# Altium schematic sheet MCU.SchDoc
size A3; DocumentNumber: 5; SheetNumber: 5; SheetTotal: 10
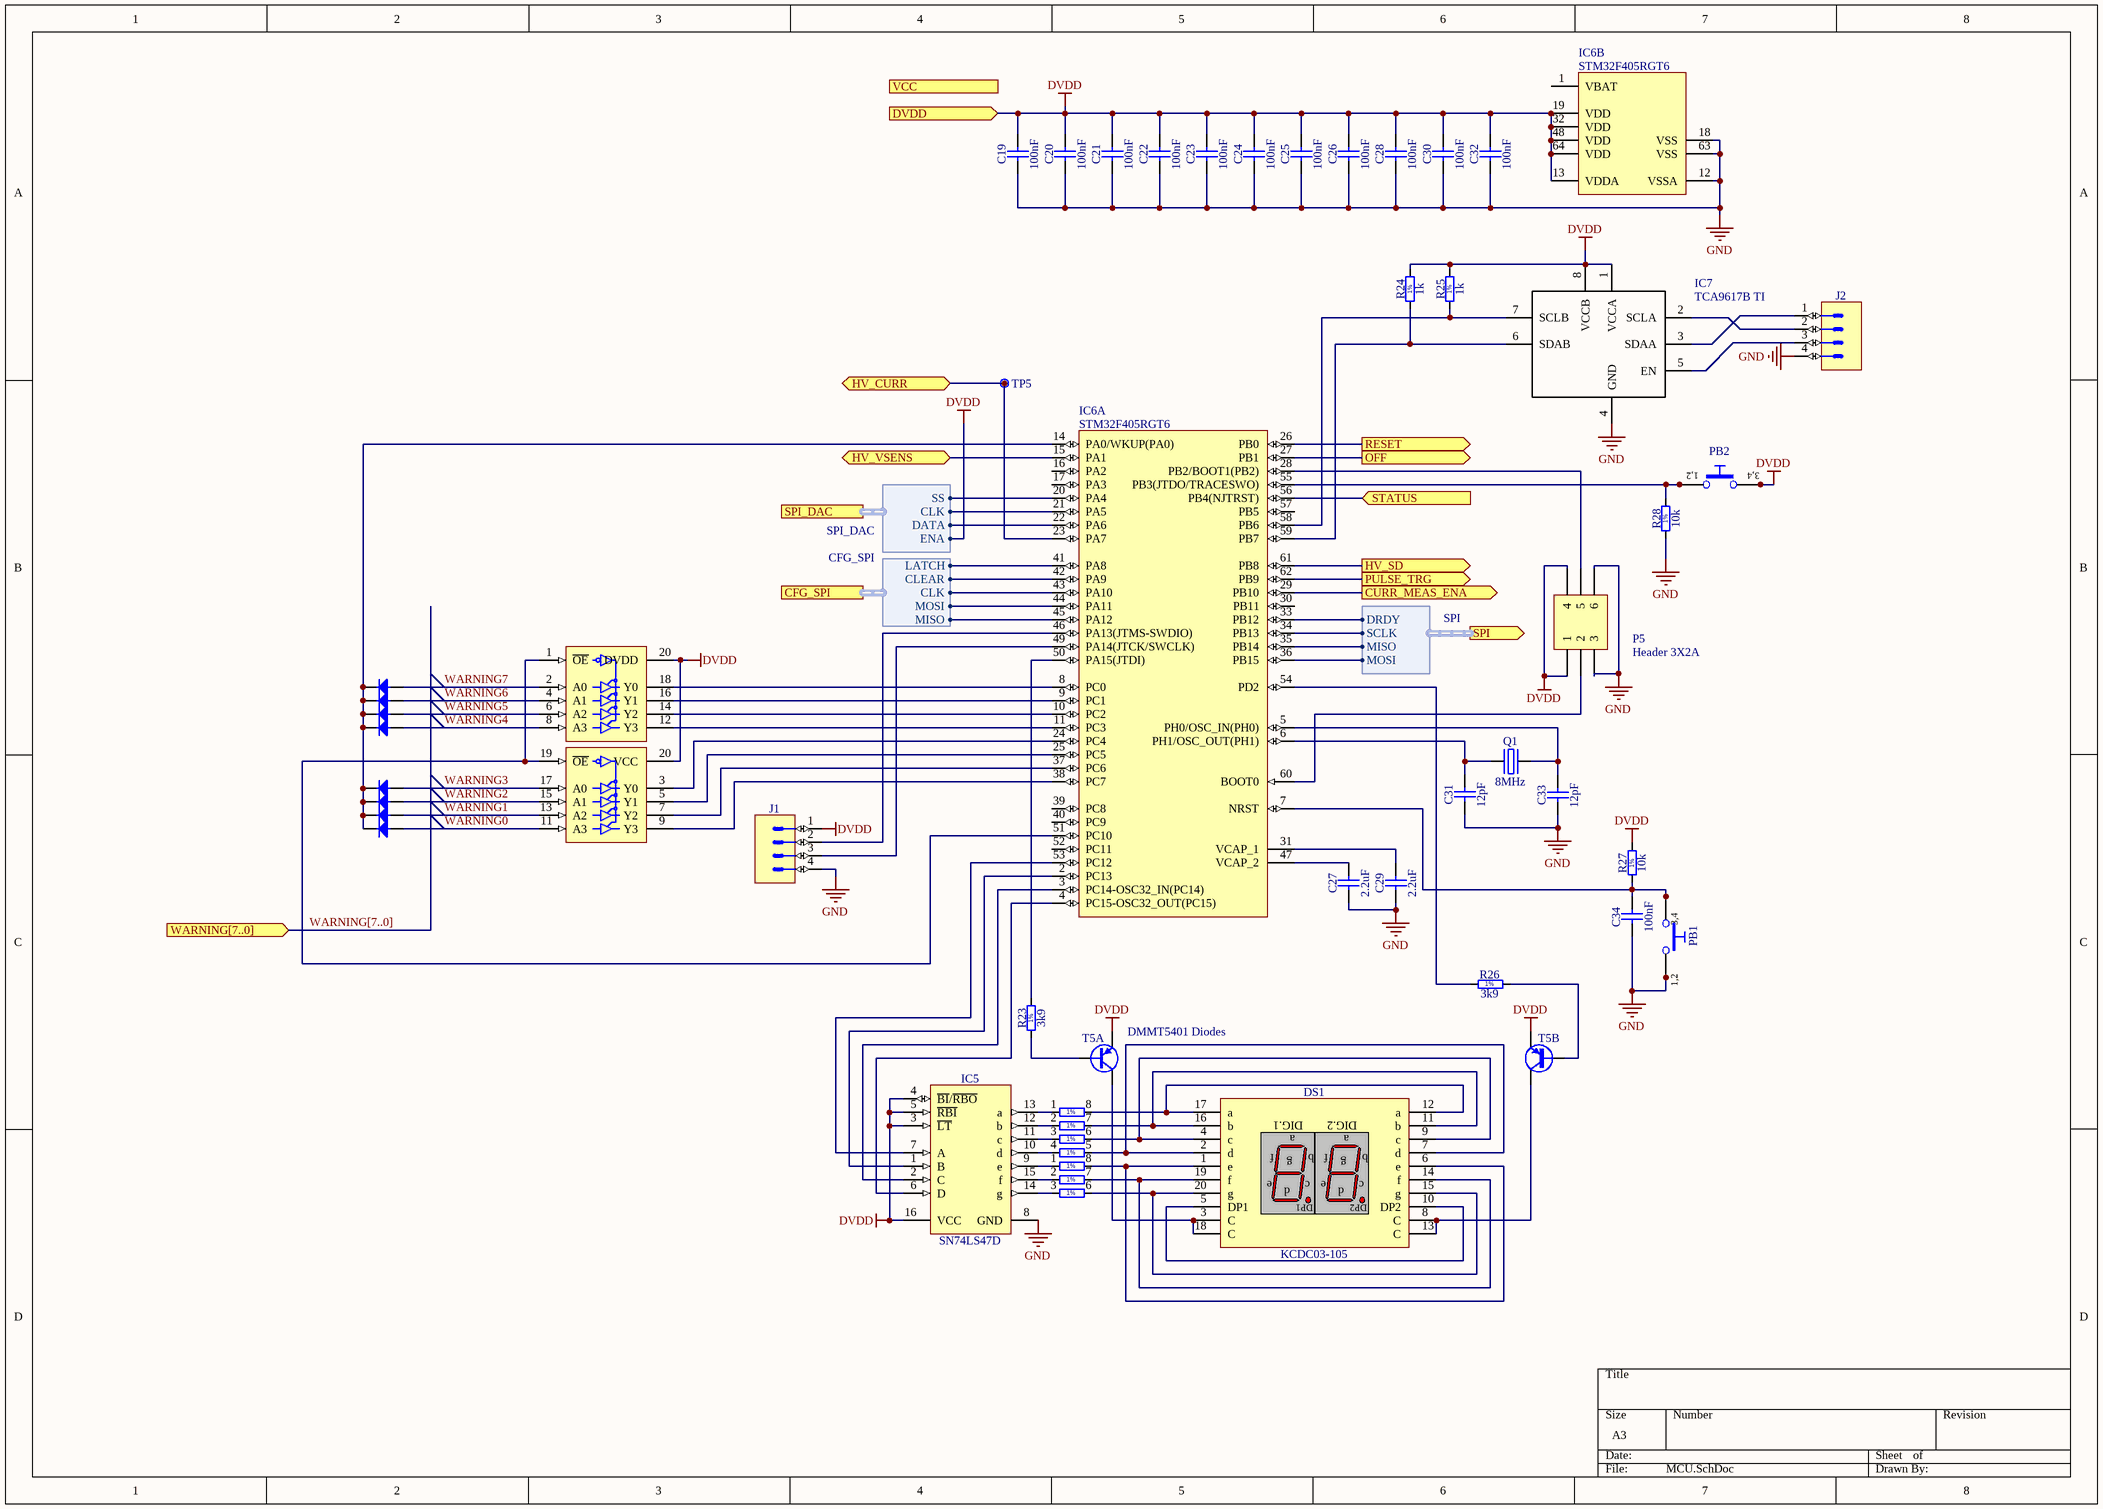
[diagram p0: MCU.SchDoc]

## Parts
C19  100nF  [CAPC2012X135N]
C20  100nF  [CAPC2012X135N]
C21  100nF  [CAPC2012X135N]
C22  100nF  [CAPC2012X135N]
C23  100nF  [CAPC2012X135N]
C24  100nF  [CAPC2012X135N]
C25  100nF  [CAPC2012X135N]
C26  100nF  [CAPC2012X135N]
C27  2.2uF  [CAPC2012X135N]
C28  100nF  [CAPC2012X135N]
C29  2.2uF  [CAPC2012X135N]
C30  100nF  [CAPC2012X135N]
C31  12pF  [CAPC2012X135N]
C32  100nF  [CAPC2012X135N]
C33  12pF  [CAPC2012X135N]
C34  100nF  [CAPC2012X135N]
D3  MCL4148-TR3  [DIOMELF1911N]  (value not drawn)
D4  MCL4148-TR3  [DIOMELF1911N]  (value not drawn)
D5  MCL4148-TR3  [DIOMELF1911N]  (value not drawn)
D6  MCL4148-TR3  [DIOMELF1911N]  (value not drawn)
D7  MCL4148-TR3  [DIOMELF1911N]  (value not drawn)
D8  MCL4148-TR3  [DIOMELF1911N]  (value not drawn)
D9  MCL4148-TR3  [DIOMELF1911N]  (value not drawn)
D10  MCL4148-TR3  [DIOMELF1911N]  (value not drawn)
DS1  KCDC03-105  [DS_KINGBRIGHT_KCDC03-105]
IC4  74HCT244D  [SOIC127P1032X265-20N]  (value not drawn)  (parts A,B of 2)
IC5  SN74LS47D  [SOIC127P600X175-16N]
IC6  STM32F405RGT6  [QFP50P1200X1200X160-64N]  (parts A,B of 2)
IC7  TCA9617B TI  [TSOP65P490X110-8N]
J1  Header 4  [PRECI-DIP_350-V3-104-00-001101]  (value not drawn)
J2  Header 4  [PRECI-DIP_350-V3-104-00-001101]  (value not drawn)
P5  Header 3X2A  [HDR2X3_CEN]
PB1  Push Button  [PB_OMRON_B3F-1000]  (value not drawn)
PB2  Push Button  [PB_OMRON_B3F-1000]  (value not drawn)
Q1  8MHz  [XTAL_TXC_7A]
R23  3k9  [RESC2012X60N]
R24  1k  [RESC2012X60N]
R25  1k  [RESC2012X60N]
R26  3k9  [RESC2012X60N]
R27  10k  [RESC2012X60N]
R28  10k  [RESC2012X60N]
RN1  220  [RN_VISHAY_CRA12E08]  (value not drawn)  (parts A,B,C,D of 4)
RN2  220  [RN_VISHAY_CRA12E08]  (value not drawn)  (parts A,B,C of 4)
T5  DMMT5401 Diodes  [SOT95P280X145-6N]  (parts A,B of 2)
TP5  Test Point  [VERO_20-2136]  (value not drawn)

## Ports
CFG_SPI (harness CFG_SPI), CURR_MEAS_ENA (out), DVDD (in), HV_CURR (bidir), HV_SD (out), HV_VSENS (bidir), OFF (out), PULSE_TRG (out), RESET (out), SPI (out, harness SPI), SPI_DAC (harness SPI_DAC), STATUS (in), VCC (in), WARNING[7..0] (in)

## Harnesses
SPI_DAC: SS, CLK, DATA, ENA
SPI: DRDY, MISO, SCLK, MOSI
CFG_SPI: LATCH, CLEAR, CLK, MOSI, MISO

## Nets
DVDD: C19.2 C20.2 C21.2 C22.2 C23.2 C24.2 C25.2 C26.2 C28.2 C30.2 C32.2 IC4.20(DVDD) IC5.3(~{LT}) IC5.4(~{BI}/~{RBO}) IC5.5(~{RBI}) IC5.16(VCC) IC6.13(VDDA) IC6.19(VDD) IC6.32(VDD) IC6.48(VDD) IC6.64(VDD) IC7.1(VCCA) IC7.8(VCCB) J1.1 P5.1 P5.4 PB2.3 PB2.4 R24.2 R25.2 R27.2 T5.5(E) T5.6(E) ; port DVDD, port SPI_DAC.ENA
GND: C19.1 C20.1 C21.1 C22.1 C23.1 C24.1 C25.1 C26.1 C27.1 C28.1 C29.1 C30.1 C31.1 C32.1 C33.1 C34.1 IC4.10(GND) IC5.8(GND) IC6.12(VSSA) IC6.18(VSS) IC6.63(VSS) IC7.4(GND) J1.4 J2.4 P5.3 P5.6 PB1.1 PB1.2 R28.1
CURR_MEAS_ENA: IC6.29(PB10) ; port CURR_MEAS_ENA
HV_CURR: IC6.23(PA7) TP5.1 ; port HV_CURR
HV_SD: IC6.61(PB8) ; port HV_SD
HV_VSENS: IC6.15(PA1) ; port HV_VSENS
OFF: IC6.27(PB1) ; port OFF
PULSE_TRG: IC6.62(PB9) ; port PULSE_TRG
RESET: IC6.26(PB0) ; port RESET
STATUS: IC6.56(PB4(NJTRST)) ; port STATUS
WARNING0: D10.2(A) IC4.11(A3)
WARNING1: D9.2(A) IC4.13(A2)
WARNING2: D8.2(A) IC4.15(A1)
WARNING3: D7.2(A) IC4.17(A0)
WARNING4: D6.2(A) IC4.8(A3)
WARNING5: D5.2(A) IC4.6(A2)
WARNING6: D4.2(A) IC4.4(A1)
WARNING7: D3.2(A) IC4.2(A0)
NetC27_2: C27.2 IC6.47(VCAP_2)
NetC29_2: C29.2 IC6.31(VCAP_1)
NetC31_2: C31.2 IC6.6(PH1/OSC_OUT(PH1)) Q1.1(OSC1)
NetC33_2: C33.2 IC6.5(PH0/OSC_IN(PH0)) Q1.2(OSC2)
NetC34_2: C34.2 IC6.7(NRST) PB1.3 PB1.4 R27.1
NetD3_1: D3.1(C) D4.1(C) D5.1(C) D6.1(C) D7.1(C) D8.1(C) D9.1(C) D10.1(C) IC6.14(PA0/WKUP(PA0))
NetDS1_1: DS1.1(e) DS1.6(e) RN2.8
NetDS1_2: DS1.2(d) DS1.7(d) RN1.5
NetDS1_3: DS1.3(C) DS1.18(C) T5.1(C)
NetDS1_4: DS1.4(c) DS1.9(c) RN1.6
NetDS1_5: DS1.5(DP1) DS1.10(DP2)
NetDS1_8: DS1.8(C) DS1.13(C) T5.4(C)
NetDS1_11: DS1.11(b) DS1.16(b) RN1.7
NetDS1_12: DS1.12(a) DS1.17(a) RN1.8
NetDS1_14: DS1.14(f) DS1.19(f) RN2.7
NetDS1_15: DS1.15(g) DS1.20(g) RN2.6
NetIC4_1: IC4.1(~{OE}) IC4.19(~{OE}) IC6.51(PC10)
NetIC4_3: IC4.3(Y0) IC6.24(PC4)
NetIC4_5: IC4.5(Y1) IC6.25(PC5)
NetIC4_7: IC4.7(Y2) IC6.37(PC6)
NetIC4_9: IC4.9(Y3) IC6.38(PC7)
NetIC4_12: IC4.12(Y3) IC6.11(PC3)
NetIC4_14: IC4.14(Y2) IC6.10(PC2)
NetIC4_16: IC4.16(Y1) IC6.9(PC1)
NetIC4_18: IC4.18(Y0) IC6.8(PC0)
NetIC5_1: IC5.1(B) IC6.2(PC13)
NetIC5_2: IC5.2(C) IC6.3(PC14-OSC32_IN(PC14))
NetIC5_6: IC5.6(D) IC6.4(PC15-OSC32_OUT(PC15))
NetIC5_7: IC5.7(A) IC6.53(PC12)
NetIC5_9: IC5.9(e) RN2.1
NetIC5_10: IC5.10(d) RN1.4
NetIC5_11: IC5.11(c) RN1.3
NetIC5_12: IC5.12(b) RN1.2
NetIC5_13: IC5.13(a) RN1.1
NetIC5_14: IC5.14(g) RN2.3
NetIC5_15: IC5.15(f) RN2.2
NetIC6_20: IC6.20(PA4) ; port SPI_DAC.SS
NetIC6_21: IC6.21(PA5) ; port SPI_DAC.CLK
NetIC6_22: IC6.22(PA6) ; port SPI_DAC.DATA
NetIC6_28: IC6.28(PB2/BOOT1(PB2)) P5.5
NetIC6_33: IC6.33(PB12) ; port SPI.DRDY
NetIC6_34: IC6.34(PB13) ; port SPI.SCLK
NetIC6_35: IC6.35(PB14) ; port SPI.MISO
NetIC6_36: IC6.36(PB15) ; port SPI.MOSI
NetIC6_41: IC6.41(PA8) ; port CFG_SPI.LATCH
NetIC6_42: IC6.42(PA9) ; port CFG_SPI.CLEAR
NetIC6_43: IC6.43(PA10) ; port CFG_SPI.CLK
NetIC6_44: IC6.44(PA11) ; port CFG_SPI.MOSI
NetIC6_45: IC6.45(PA12) ; port CFG_SPI.MISO
NetIC6_46: IC6.46(PA13(JTMS-SWDIO)) J1.2
NetIC6_49: IC6.49(PA14(JTCK/SWCLK)) J1.3
NetIC6_50: IC6.50(PA15(JTDI)) R23.2
NetIC6_54: IC6.54(PD2) R26.1
NetIC6_55: IC6.55(PB3(JTDO/TRACESWO)) PB2.1 PB2.2 R28.2
NetIC6_58: IC6.58(PB6) IC7.7(SCLB) R25.1
NetIC6_59: IC6.59(PB7) IC7.6(SDAB) R24.1
NetIC6_60: IC6.60(BOOT0) P5.2
NetIC7_2: IC7.2(SCLA) J2.2
NetIC7_3: IC7.3(SDAA) J2.1
NetIC7_5: IC7.5(EN) J2.3
NetR23_1: R23.1 T5.2(B)
NetR26_2: R26.2 T5.3(B)

Not connected (* = marked no-connect by the designer): IC6 1(VBAT) 16(PA2) 17(PA3) 30(PB11) 39(PC8) 40(PC9) 52(PC11) 57(PB5)

## Buses and harness runs
bus WARNING[7..0] = port WARNING[7..0]

## Notes on the sheet
- (in symbol DS_KINGBRIGHT_KCDC03-105) DIG.1; DIG.2
- (in symbol PB_OMRON_B3F-1000) 3,4; 1,2
- (in symbol R0805_1K_1%_0.125W_100PPM) 1%
- (in symbol R0805_3K9_1%_0.125W_100PPM) 1%
- (in symbol R0805_10K_1%_0.125W_100PPM) 1%
- (in symbol RN_220R_VISHAY_CRA12E083220RF, part A) 1%
- (in symbol RN_220R_VISHAY_CRA12E083220RF, part B) 1%
- (in symbol RN_220R_VISHAY_CRA12E083220RF, part C) 1%
- (in symbol RN_220R_VISHAY_CRA12E083220RF, part D) 1%

## Library data of the parts
C19-C26 C28 C30 C32 C34 = CC0805_100NF_50V_10%_X7R: Non-polarised capacitor; Part Description: SMD Multilayer Chip Ceramic Capacitor; Manufacturer: GENERIC; Manufacturer1 Part Number: C2012X7R1H104K085AA; Voltage: 50V; TC: X7R; Tolerance: ±10%; Part Number: CC0805_100NF_50V_10%_X7R; Component Kind: Standard; Component Type: Standard; Pin Count: 2; Value: 100nF; Status: Preferred; Manufacturer Part Number: CC0805_100NF_50V_10%_X7R; Case: 0805; Mounted: Yes; Socket: No; SMD: Yes; Sense: No; Manufacturer1 Example: TDK; Manufacturer1 ComponentHeight: 1mm; HelpURL: \\cern.ch\dfs\Applications\Altium\Datasheets\CC0805_X7R_TDK_C.pdf; Author: CERN DEM JLC; CreateDate: 03.12.2007; LatestRevisionDate: 22.04.2015
C27 C29 = CC0805_2.2UF_16V_10%_X7R: Non-polarised capacitor; Part Description: SMD Multilayer Chip Ceramic Capacitor; Manufacturer: GENERIC; Manufacturer1 Part Number: GRM21BF51C225ZA01L; Voltage: 16V; TC: X7R; Tolerance: ±10%; Part Number: CC0805_2.2UF_16V_10%_X7R; Component Kind: Standard; Component Type: Standard; Pin Count: 2; Value: 2.2uF; Status: Preferred; Manufacturer Part Number: CC0805_2.2UF_16V_10%_X7R; Case: 0805; Mounted: Yes; Socket: No; SMD: Yes; Sense: No; Manufacturer1 Example: MURATA; Manufacturer1 ComponentHeight: 1.5mm; HelpURL: \\cern.ch\dfs\Applications\Altium\Datasheets\CC0805_X7R_MURATA_GRM.pdf; Author: CERN DEM JLC; CreateDate: 03.12.2007; LatestRevisionDate: 18.09.2014
C31 C33 = CC0805_12PF_50V_5%_NP0: Non-polarised capacitor; Part Description: SMD Multilayer Chip Ceramic Capacitor; Manufacturer: GENERIC; Manufacturer1 Part Number: 223886115129; Voltage: 50V; TC: C0G/NP0; Tolerance: ±5%; Part Number: CC0805_12PF_50V_5%_NP0; Component Kind: Standard; Component Type: Standard; Pin Count: 2; Value: 12pF; Status: Preferred; Manufacturer Part Number: CC0805_12PF_50V_5%_NP0; Case: 0805; Mounted: Yes; Socket: No; SMD: Yes; Sense: No; Manufacturer1 Example: PHYCOMP; Manufacturer1 ComponentHeight: 1.35mm; HelpURL: \\cern.ch\dfs\Applications\Altium\Datasheets\CC0805_NP0_PHYCOMP.pdf; Author: CERN DEM JLC; CreateDate: 03.12.2007; LatestRevisionDate: 03.12.2007
D3-D10 = MCL4148-TR3: Diode; Part Description: Small Signal Fast Switching Diode; Manufacturer: VISHAY GENERAL SEMICONDUCTOR; Voltage: 75V; Power: 200mA; PressFit: No; Bonding: No; Part Number: MCL4148-TR3; Component Kind: Standard; Component Type: Standard; Device: MCL4148-TR3; PackageDescription: MELF Diode, 2-Leads, Body 1.7x1.15mm, IPC Medium Density; Status: Not recommended; Manufacturer Part Number: MCL4148-TR3; Pin Count: 2; Mounted: Yes; Socket: No; SMD: Yes; Sense: No; ComponentHeight: 1.35mm; HelpURL: \\cern.ch\dfs\Applications\Altium\Datasheets\MCL4148-TR3.pdf; Author: CERN DEM JLC; CreateDate: 10.11.2014; LatestRevisionDate: 10.11.2014
DS1 = DS_KINGBRIGHT_KCDC03-105: Dual Digit, SMD 7-Segment Common Cathode Hyper Red Display; PressFit: No; Bonding: No; Part Number: DS_KINGBRIGHT_KCDC03-105; Component Kind: Standard; Component Type: Standard; Color: Hyper Red; Device: KCDC03-105; PackageDescription: 20-Leads, Body 14.8x12mm, Pitch 1.5mm, Hyper Red SMD Common Cathode Dual 7-SegmentDisplay; Part Description: Dual Digit, SMD 7-Segment Common Cathode Hyper Red Display; Manufacturer: KINGBRIGHT; Manufacturer Part Number: KCDC03-105; Pin Count: 20; Mounted: Yes; Socket: No; SMD: Yes; Sense: No; ComponentHeight: 3.75mm; HelpURL: \\cern.ch\dfs\Applications\Altium\Datasheets\DS_KINGBRIGHT_KCDC03-105.pdf; Author: CERN DEM JLC; CreateDate: 12.05.2014; LatestRevisionDate: 21.10.2016
IC4 = 74HCT244D: Octal Buffer And Line Driver with 3-State Ouputs; Part Description: Octal Buffer/Line Driver with 3-State Outputs; Manufacturer: NXP SEMICONDUCTORS; PressFit: No; Bonding: No; Part Number: 74HCT244D; Component Kind: Standard; Component Type: Standard; Device: 74HCT244D; PackageDescription: SOIC, 1.27mm pitch; 20 pin, 7.50mm W X 12.80mm L X 2.65mm H body, IPC Medium Density; Manufacturer Part Number: 74HCT244D; Pin Count: 20; Case: SOIC20; Mounted: Yes; Socket: No; SMD: Yes; Sense: No; ComponentHeight: 2.65mm; Author: CERN DEM JLC; HelpURL: \\cern.ch\dfs\Applications\Altium\Datasheets\74HCT244D.pdf; CreateDate: 27.08.2013; LatestRevisionDate: 27.08.2013
IC5 = SN74LS47D: BCD-to-Seven-Segment Decoder/Driver; Manufacturer: TEXAS INSTRUMENTS; PressFit: No; Bonding: No; Part Number: SN74LS47D; Component Kind: Standard; Component Type: Standard; Device: SN74LS47D; PackageDescription: SOIC 16, Pitch 1.27mm - Body 4x10mm, IPC Medium Density; Part Description: BCD-to-Seven-Segment Decoder/Driver; Manufacturer Part Number: SN74LS47D; Pin Count: 16; Case: SOIC16; Mounted: Yes; Socket: No; SMD: Yes; Sense: No; ComponentHeight: 1.75mm; Author: CERN DEM JMW; HelpURL: \\cern.ch\dfs\Applications\Altium\Datasheets\SN74LS47D.pdf; CreateDate: 04.10.2012; LatestRevisionDate: 04.10.2012
IC6 = STM32F405RGT6: ARM Cortex-M4 32-bit MCU+FPU, 210DMIPS, 1024kB Flash, 192kB+4kB RAM, 51 I/Os, 64-pin LQFP, Industrial Grade –40 to 85°C; Manufacturer: ST MICROELECTRONICS; PressFit: No; Bonding: No; Part Number: STM32F405RGT6; Component Kind: Standard; Component Type: Standard; Device: STM32F405RGT6; PackageDescription: QFP, 0.50mm pitch, square; 16 pin X 16 pin, 10.00mm X 10.00mm, 1.6mm H, IPC Medium Density; Part Description: ARM Cortex-M4 32-bit MCU+FPU, 210DMIPS, 1024kB Flash, 192kB+4kB RAM, 51 I/Os, 64-pin LQFP, Industrial Grade –40 to 85°C; Manufacturer Part Number: STM32F405RGT6; Pin Count: 64; Case: QFP64; Mounted: Yes; Socket: No; SMD: Yes; Sense: No; ComponentHeight: 1.6mm; HelpURL: \\cern.ch\dfs\Applications\Altium\Datasheets\STM32F405RGT6.pdf; Author: CERN DEM JLC; CreateDate: 20.06.2017; LatestRevisionDate: 20.06.2017
IC7 = TCA9617B: Name: TCA9617B; Manufacturer: TI
J1 J2 = PRECI-DIP_350-V3-104-00-001101: Connector 4 Male; Part Description: Pitch 2.54mm, Single Row, Straight 4 Contacts PCB Header; PressFit: No; Part Number: PRECI-DIP_350-V3-104-00-001101; Component Kind: Standard; Component Type: Standard; Pin Count: 4; Family: Header 4; Mounted: Yes; Socket: No; SMD: No; Sense: No; Status: None; Manufacturer: PRECI-DIP; Manufacturer Part Number: 350-V3-104-00-001101; ComponentHeight: 7.96mm; HelpURL: \\cern.ch\dfs\Applications\Altium\Datasheets\PRECI-DIP_350-V3-104-00-001101.pdf; Author: CERN DEM BC; CreateDate: 18.03.2016; LatestRevisionDate: 18.03.2016
P5 = Header 3X2A: Header, 3-Pin, Dual row; LatestRevisionDate: 17-Jul-2002; LatestRevisionNote: Re-released for DXP Platform.; Publisher: Altium Limited
PB1 PB2 = PB_OMRON_B3F-1000: Push-Button Switch SPDT; Part Description: 24VDC 50mA SPST-NO Tactile Push-Button Switch (h=4.5mm); Manufacturer: OMRON; PressFit: No; Part Number: PB_OMRON_B3F-1000; Component Kind: Standard; Component Type: Standard; Pin Count: 4; PackageDescription: 6x6mm Model, Horizontal, Flat Plunger Type (without Ground Terminal) Pushbutton Switch, OMRON B3F Series; Family: Push Button; Mounted: Yes; Socket: No; SMD: No; Sense: No; Status: None; Manufacturer Part Number: B3F-1000; ComponentHeight: 4.5mm; HelpURL: \\cern.ch\dfs\Applications\Altium\Datasheets\PB_OMRON_B3F-1000.pdf; Author: CERN DEM JMW; CreateDate: 23.10.2008; LatestRevisionDate: 06.05.2009
Q1 = XTAL_8MHZ_TXC_7A-8.000MAAE-T: Quartz Crystal; Part Description: Tolerance: ±30ppm, Stability: ±30ppm, -20°C to +70°C, 12pF, SMD Glass Seam Sealing Crystal, 7A Series; Manufacturer: TXC CORPORATION; PressFit: No; Bonding: No; Part Number: XTAL_8MHZ_TXC_7A-8.000MAAE-T; Component Kind: Standard; Component Type: Standard; PackageDescription: 2 Pins, 3.2x5mm, SMD Glass Seam Sealing Crystal, 7A Serie; Value: 8MHz; Manufacturer Part Number: 7A-8.000MAAE-T; Pin Count: 2; Mounted: Yes; Socket: No; SMD: Yes; Sense: No; ComponentHeight: 1.2mm; HelpURL: \\cern.ch\dfs\Applications\Altium\Datasheets\XTAL_TXC_7A.pdf; Author: CERN DEM JLC; CreateDate: 09.10.2014; LatestRevisionDate: 12.11.2014
R23 R26 = R0805_3K9_1%_0.125W_100PPM: Resistor - 1%; Part Description: General Purpose Thick Film Chip Resistor; Manufacturer: GENERIC; Manufacturer1 Part Number: NRC10F3901TRF; Power: 0.125W; TC: ±100ppm/°C; PressFit: No; Part Number: R0805_3K9_1%_0.125W_100PPM; Component Kind: Standard; Component Type: Standard; Pin Count: 2; Value: 3k9; Status: Preferred; Tolerance: ±1%; Manufacturer Part Number: R0805_3K9_1%_0.125W_100PPM; Case: 0805; Mounted: Yes; Sense: No; Socket: No; SMD: Yes; Manufacturer1 Example: NIC COMPONENT; Manufacturer1 ComponentHeight: 0.6mm; HelpURL: \\cern.ch\dfs\Applications\Altium\Datasheets\R0805_NIC_NRC.pdf; Author: CERN DEM JLC; CreateDate: 03.12.2007; LatestRevisionDate: 13.03.2008
R24 R25 = R0805_1K_1%_0.125W_100PPM: Resistor - 1%; Part Description: General Purpose Thick Film Chip Resistor; Manufacturer: GENERIC; Manufacturer1 Part Number: NRC10F1001TRF; Power: 0.125W; TC: ±100ppm/°C; PressFit: No; Part Number: R0805_1K_1%_0.125W_100PPM; Component Kind: Standard; Component Type: Standard; Pin Count: 2; Value: 1k; Status: Preferred; Tolerance: ±1%; Manufacturer Part Number: R0805_1K_1%_0.125W_100PPM; Case: 0805; Mounted: Yes; Sense: No; Socket: No; SMD: Yes; Manufacturer1 Example: NIC COMPONENT; Manufacturer1 ComponentHeight: 0.6mm; HelpURL: \\cern.ch\dfs\Applications\Altium\Datasheets\R0805_NIC_NRC.pdf; Author: CERN DEM JLC; CreateDate: 03.12.2007; LatestRevisionDate: 13.03.2008
R27 R28 = R0805_10K_1%_0.125W_100PPM: Resistor - 1%; Part Description: General Purpose Thick Film Chip Resistor; Manufacturer: GENERIC; Manufacturer1 Part Number: NRC10F1002TRF; Power: 0.125W; TC: ±100ppm/°C; PressFit: No; Part Number: R0805_10K_1%_0.125W_100PPM; Component Kind: Standard; Component Type: Standard; Pin Count: 2; Value: 10k; Status: Preferred; Tolerance: ±1%; Manufacturer Part Number: R0805_10K_1%_0.125W_100PPM; Case: 0805; Mounted: Yes; Sense: No; Socket: No; SMD: Yes; Manufacturer1 Example: NIC COMPONENT; Manufacturer1 ComponentHeight: 0.6mm; HelpURL: \\cern.ch\dfs\Applications\Altium\Datasheets\R0805_NIC_NRC.pdf; Author: CERN DEM JLC; CreateDate: 03.12.2007; LatestRevisionDate: 13.03.2008
RN1 RN2 = RN_220R_VISHAY_CRA12E083220RF: DIL8 Resistor Network 4 Isolated Resistor 1%; Part Description: Chip Resistor Array , 4 Isolated Resistors (Convex Terminal), CRA12E Series; Manufacturer: VISHAY; Power: 0.125W; TC: ±200ppm/°C; PressFit: No; Part Number: RN_220R_VISHAY_CRA12E083220RF; Component Kind: Standard; Component Type: Standard; Pin Count: 8; Value: 220; Sense: No; Tolerance: ±1%; Manufacturer Part Number: CRA12E083220RF; Mounted: Yes; Socket: No; SMD: Yes; ComponentHeight: 0.7mm; HelpURL: \\cern.ch\dfs\Applications\Altium\Datasheets\RN_VISHAY_CRA12E.pdf; Author: CERN DEM BC; CreateDate: 25.08.2015; LatestRevisionDate: 03.05.2017
T5 = DMMT5401: Name: DMMT5401; Manufacturer: Diodes
TP5 = VERO_20-2136: Part Description: Black Bead PCB Terminal Test Pin for 1.6mm PCB Thickness (1.32mm Hole); Manufacturer: VERO TECHNOLOGIES; PressFit: No; Part Number: VERO_20-2136; Component Kind: Standard; Component Type: Standard; Pin Count: 1; Family: Test Point; Mounted: Yes; Socket: No; SMD: No; Sense: No; Status: None; Manufacturer Part Number: 20-2136; ComponentHeight: 5.3mm; HelpURL: \\cern.ch\dfs\Applications\Altium\Datasheets\VERO_20-2136.pdf; Author: CERN DEM JLC; CreateDate: 21.07.2008; LatestRevisionDate: 15.07.2013